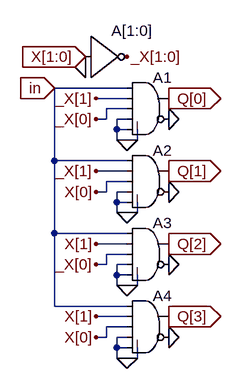
[diagram p0: schematic demux-1bit-1to4.asc]
demux-1bit-1to4.asc, the LTspice schematic file:
Version 4
SHEET 1 880 680
WIRE 32 48 -80 48
WIRE 32 64 -16 64
WIRE 32 80 0 80
WIRE 0 96 0 80
WIRE 0 96 -16 96
WIRE 32 96 16 96
WIRE 16 112 16 96
WIRE 32 112 16 112
WIRE 16 128 16 112
WIRE 32 128 16 128
WIRE 48 128 48 112
WIRE 48 128 32 128
WIRE -80 160 -80 48
WIRE 32 160 -80 160
WIRE 32 176 -16 176
WIRE 32 192 0 192
WIRE 0 208 0 192
WIRE 0 208 -16 208
WIRE 32 208 16 208
WIRE 16 224 16 208
WIRE 32 224 16 224
WIRE 16 240 16 224
WIRE 32 240 16 240
WIRE 48 240 48 224
WIRE 48 240 32 240
WIRE -80 272 -80 160
WIRE 32 272 -80 272
WIRE 32 288 -16 288
WIRE 32 304 0 304
WIRE 0 320 0 304
WIRE 0 320 -16 320
WIRE 32 320 16 320
WIRE 16 336 16 320
WIRE 32 336 16 336
WIRE 16 352 16 336
WIRE 32 352 16 352
WIRE 48 352 48 336
WIRE 48 352 32 352
WIRE -80 384 -80 272
WIRE 32 384 -80 384
WIRE 32 400 -16 400
WIRE 32 416 0 416
WIRE 0 432 0 416
WIRE 0 432 -16 432
WIRE 32 432 16 432
WIRE 16 448 16 432
WIRE 32 448 16 448
WIRE 16 464 16 448
WIRE 32 464 16 464
WIRE 48 464 48 448
WIRE 48 464 32 464
FLAG 32 128 0
FLAG 32 240 0
FLAG 96 96 0
FLAG 96 208 0
FLAG -80 48 in
IOPIN -80 48 In
FLAG 96 64 Q[0]
IOPIN 96 64 Out
FLAG 96 176 Q[1]
IOPIN 96 176 Out
FLAG -32 16 0
FLAG -32 0 X[1:0]
IOPIN -32 0 In
FLAG 32 0 _X[1:0]
FLAG -16 64 _X[1]
FLAG -16 96 _X[0]
FLAG -16 176 _X[1]
FLAG -16 208 X[0]
FLAG 32 352 0
FLAG 32 464 0
FLAG 96 320 0
FLAG 96 432 0
FLAG 96 288 Q[2]
IOPIN 96 288 Out
FLAG 96 400 Q[3]
IOPIN 96 400 Out
FLAG -16 288 X[1]
FLAG -16 320 _X[0]
FLAG -16 400 X[1]
FLAG -16 432 X[0]
SYMBOL Digital\\and 64 16 R0
SYMATTR InstName A1
SYMBOL Digital\\and 64 128 R0
SYMATTR InstName A2
SYMBOL Digital\\inv -32 -64 R0
SYMATTR InstName A[1:0]
SYMBOL Digital\\and 64 240 R0
SYMATTR InstName A3
SYMBOL Digital\\and 64 352 R0
SYMATTR InstName A4

The netlist it stands for:
* demux-1bit-1to4.asc
A1 in _X[1] _X[0] 0 0 0 Q[0] 0 AND
A2 in _X[1] X[0] 0 0 0 Q[1] 0 AND
A[1:0] X[1:0] 0 0 0 0 _X[1:0] 0 0 BUF
A3 in X[1] _X[0] 0 0 0 Q[2] 0 AND
A4 in X[1] X[0] 0 0 0 Q[3] 0 AND
.backanno
.end